# Altium schematic sheet Data_IO.SchDoc
size A3; SheetNumber: 1
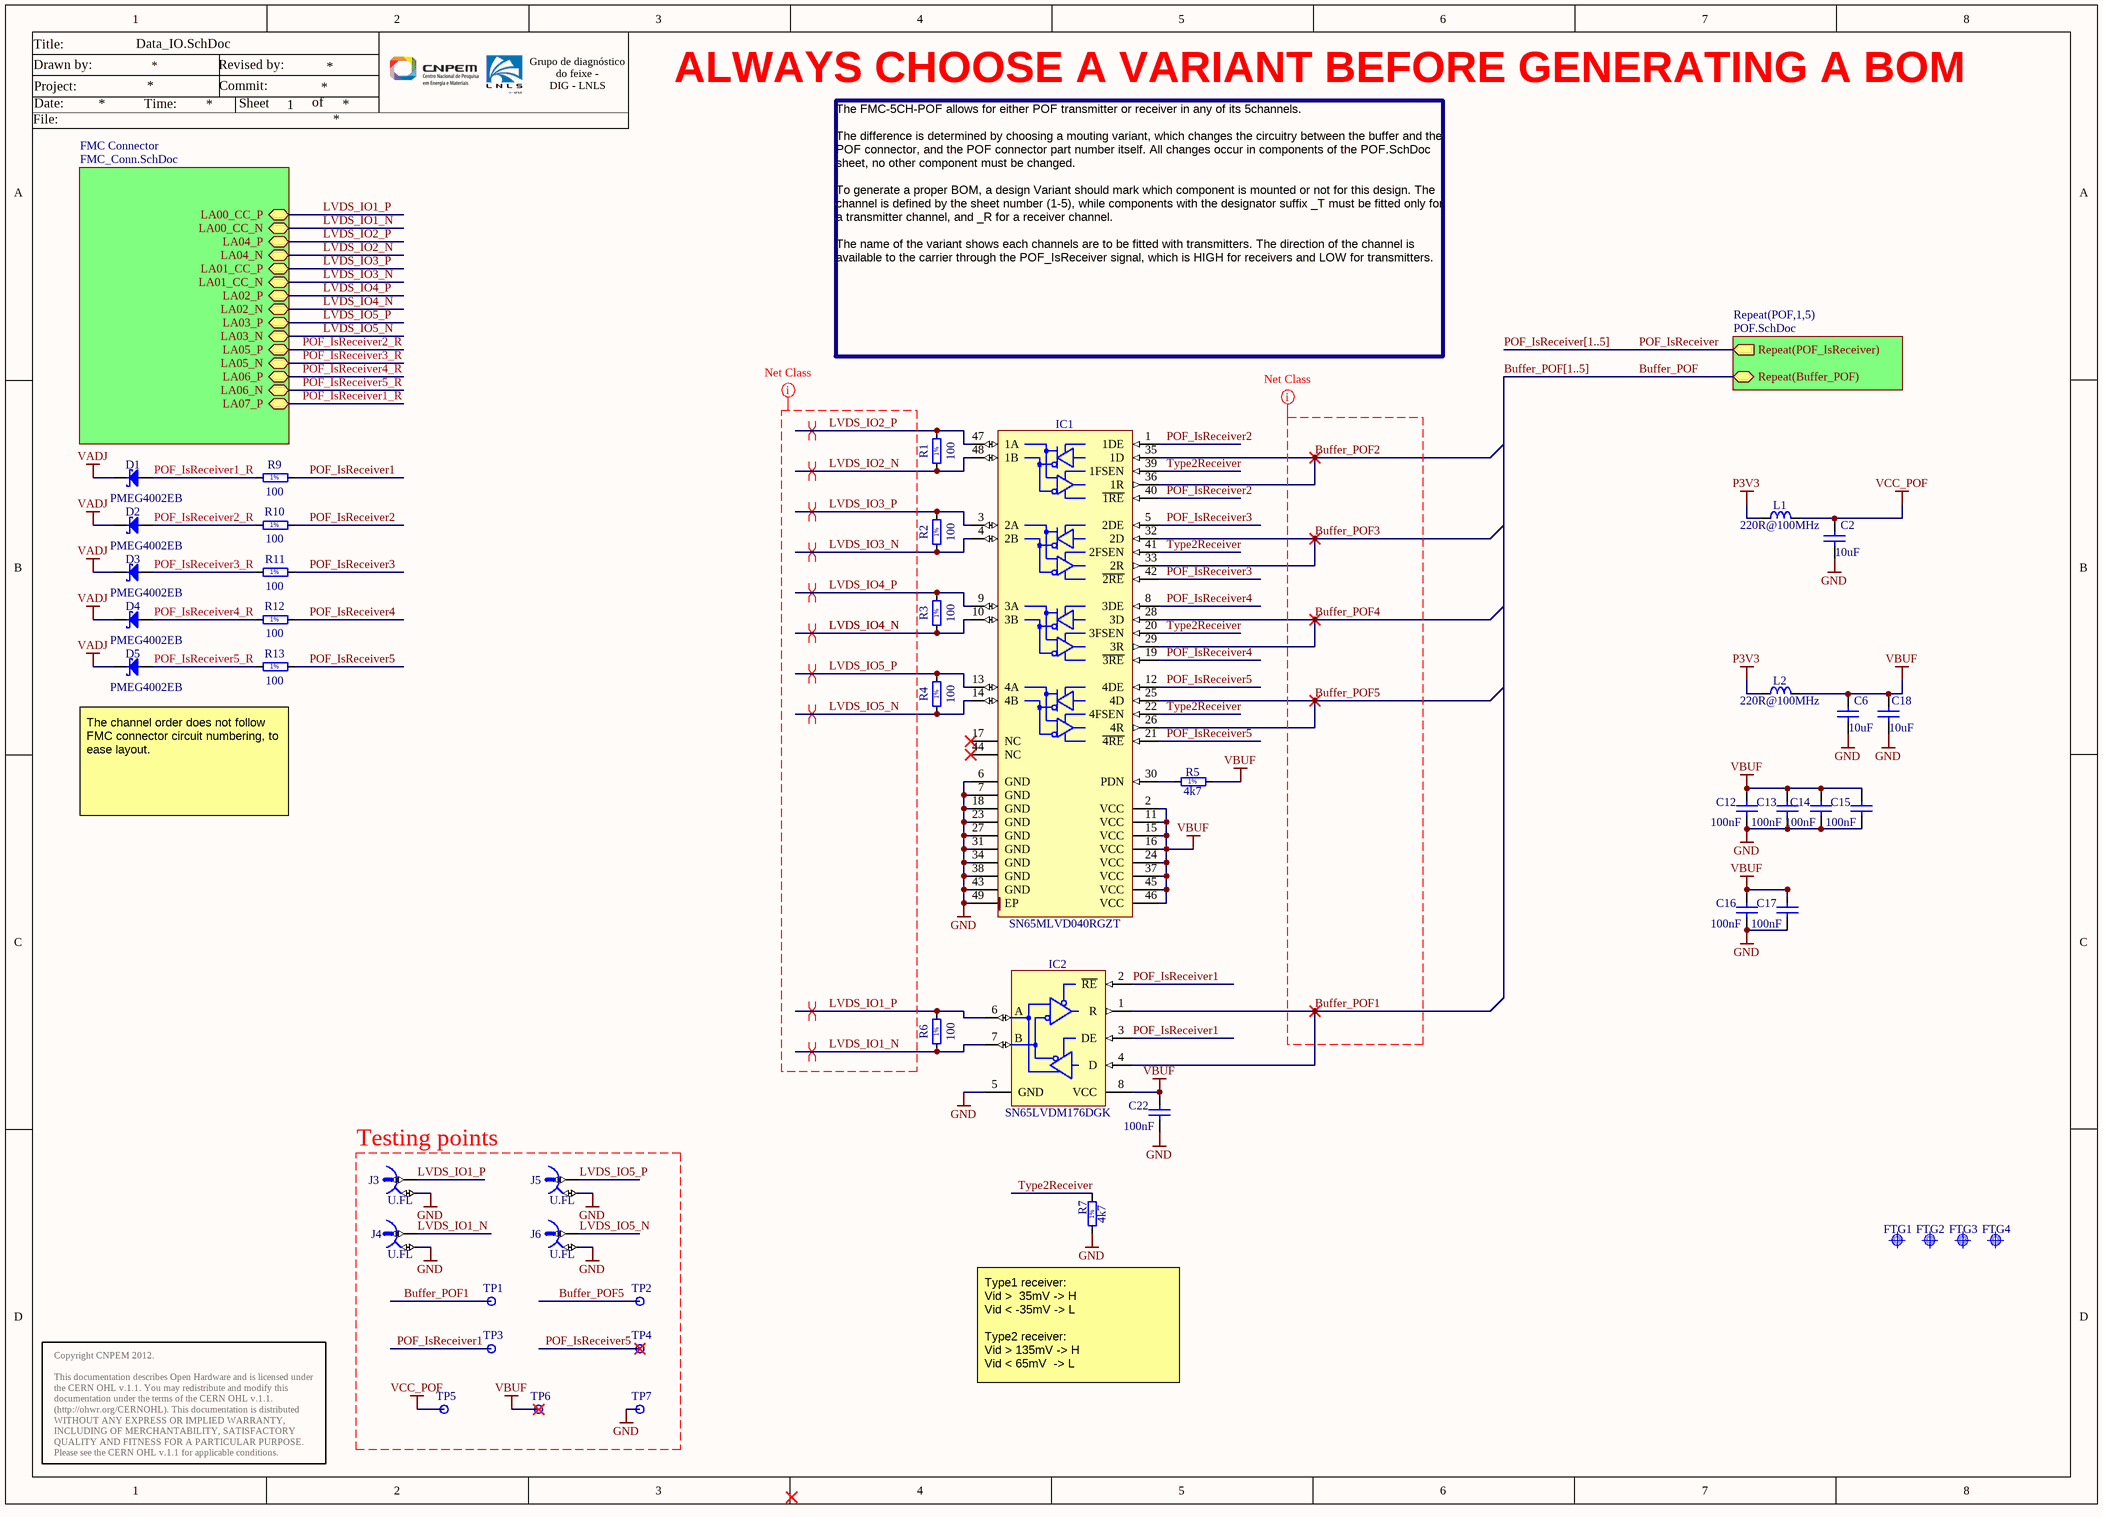
[diagram p0: Data_IO.SchDoc]

## Parts
C2  10uF  [CAPC2012X135N]
C6  10uF  [CAPC2012X135N]
C12  100nF  [CAPC1005X55N]
C13  100nF  [CAPC1005X55N]
C14  100nF  [CAPC1005X55N]
C15  100nF  [CAPC1005X55N]
C16  100nF  [CAPC1005X55N]
C17  100nF  [CAPC1005X55N]
C18  10uF  [CAPC2012X135N]
C22  100nF  [CAPC1005X55N]
D1  PMEG4002EB  [SODFL1608X65N]
D2  PMEG4002EB  [SODFL1608X65N]
D3  PMEG4002EB  [SODFL1608X65N]
D4  PMEG4002EB  [SODFL1608X65N]
D5  PMEG4002EB  [SODFL1608X65N]
FTG1  Use only in PCB  [FIDUCIAL_TOP_S100-200]  (value not drawn)
FTG2  Use only in PCB  [FIDUCIAL_TOP_S100-200]  (value not drawn)
FTG3  Use only in PCB  [FIDUCIAL_TOP_S100-200]  (value not drawn)
FTG4  Use only in PCB  [FIDUCIAL_TOP_S100-200]  (value not drawn)
IC1  SN65MLVD040RGZT  [QFN50P700X700X100-49N-S420]
IC2  SN65LVDM176DGK  [SOP65P490X110-8N]
J3  U.FL  [HIROSE_U.FL-R-SMT-1(10)]
J4  U.FL  [HIROSE_U.FL-R-SMT-1(10)]
J5  U.FL  [HIROSE_U.FL-R-SMT-1(10)]
J6  U.FL  [HIROSE_U.FL-R-SMT-1(10)]
L1  220R@100MHz  [INDC2012X105N]
L2  220R@100MHz  [INDC2012X105N]
R1  100  [RESC1005X40N]
R2  100  [RESC1005X40N]
R3  100  [RESC1005X40N]
R4  100  [RESC1005X40N]
R5  4k7  [RESC1005X40N]
R6  100  [RESC1005X40N]
R7  4k7  [RESC1005X40N]
R9  100  [RESC1005X40N]
R10  100  [RESC1005X40N]
R11  100  [RESC1005X40N]
R12  100  [RESC1005X40N]
R13  100  [RESC1005X40N]
TP1  Plated Hole  [c300h160]  (value not drawn)
TP2  Plated Hole  [c300h160]  (value not drawn)
TP3  Plated Hole  [c300h160]  (value not drawn)
TP4  Plated Hole  [c300h160]  (value not drawn)
TP5  Plated Hole  [c300h160]  (value not drawn)
TP6  Plated Hole  [c300h160]  (value not drawn)
TP7  Plated Hole  [c300h160]  (value not drawn)

## Sub-sheets
FMC Connector = FMC_Conn.SchDoc: LA00_CC_P, LA00_CC_N, LA04_N, LA04_P, LA01_CC_P, LA01_CC_N, LA02_N, LA02_P, LA03_N, LA03_P, LA06_P, LA06_N, LA07_P, LA05_P, LA05_N
Repeat(POF,1,5) = POF.SchDoc: Repeat(Buffer_POF) (bidir), Repeat(POF_IsReceiver) (out)

## Nets
GND: C2.1 C6.1 C12.1 C13.1 C14.1 C15.1 C16.1 C17.1 C18.1 C22.1 IC1.6(GND) IC1.7(GND) IC1.18(GND) IC1.23(GND) IC1.27(GND) IC1.31(GND) IC1.34(GND) IC1.38(GND) IC1.43(GND) IC1.49(EP) IC2.5(GND) J3.2 J4.2 J5.2 J6.2 R7.1 TP7.1
P3V3: L1.1 L2.1
VADJ: D1.1(C) D2.1(C) D3.1(C) D4.1(C) D5.1(C)
VBUF: C6.2 C12.2 C13.2 C14.2 C15.2 C16.2 C17.2 C18.2 C22.2 IC1.2(VCC) IC1.11(VCC) IC1.15(VCC) IC1.16(VCC) IC1.24(VCC) IC1.37(VCC) IC1.45(VCC) IC1.46(VCC) IC2.8(VCC) L2.2 R5.2 TP6.1
VCC_POF: C2.2 L1.2 TP5.1
Buffer_POF: sheet Repeat(POF,1,5)/Repeat(Buffer_POF)
Buffer_POF1: IC2.1(R) IC2.4(D) TP1.1
Buffer_POF2: IC1.35(1D) IC1.36(1R)
Buffer_POF3: IC1.32(2D) IC1.33(2R)
Buffer_POF4: IC1.28(3D) IC1.29(3R)
Buffer_POF5: IC1.25(4D) IC1.26(4R) TP2.1
LVDS_IO1_N: IC2.7(B) J4.1 R6.1 ; sheet FMC Connector/LA00_CC_N
LVDS_IO1_P: IC2.6(A) J3.1 R6.2 ; sheet FMC Connector/LA00_CC_P
LVDS_IO2_N: IC1.48(1B) R1.1 ; sheet FMC Connector/LA04_N
LVDS_IO2_P: IC1.47(1A) R1.2 ; sheet FMC Connector/LA04_P
LVDS_IO3_N: IC1.4(2B) R2.1 ; sheet FMC Connector/LA01_CC_N
LVDS_IO3_P: IC1.3(2A) R2.2 ; sheet FMC Connector/LA01_CC_P
LVDS_IO4_N: IC1.10(3B) R3.1 ; sheet FMC Connector/LA02_N
LVDS_IO4_P: IC1.9(3A) R3.2 ; sheet FMC Connector/LA02_P
LVDS_IO5_N: IC1.14(4B) J6.1 R4.1 ; sheet FMC Connector/LA03_N
LVDS_IO5_P: IC1.13(4A) J5.1 R4.2 ; sheet FMC Connector/LA03_P
POF_IsReceiver: sheet Repeat(POF,1,5)/Repeat(POF_IsReceiver)
POF_IsReceiver1: IC2.2(~{RE}) IC2.3(DE) R9.2 TP3.1
POF_IsReceiver1_R: D1.2(A) R9.1 ; sheet FMC Connector/LA07_P
POF_IsReceiver2: IC1.1(1DE) IC1.40(~{1RE}) R10.2
POF_IsReceiver2_R: D2.2(A) R10.1 ; sheet FMC Connector/LA05_P
POF_IsReceiver3: IC1.5(2DE) IC1.42(~{2RE}) R11.2
POF_IsReceiver3_R: D3.2(A) R11.1 ; sheet FMC Connector/LA05_N
POF_IsReceiver4: IC1.8(3DE) IC1.19(~{3RE}) R12.2
POF_IsReceiver4_R: D4.2(A) R12.1 ; sheet FMC Connector/LA06_P
POF_IsReceiver5: IC1.12(4DE) IC1.21(~{4RE}) R13.2 TP4.1
POF_IsReceiver5_R: D5.2(A) R13.1 ; sheet FMC Connector/LA06_N
Type2Receiver: IC1.20(3FSEN) IC1.22(4FSEN) IC1.39(1FSEN) IC1.41(2FSEN) R7.2
NetIC1_30: IC1.30(PDN) R5.1

Not connected (* = marked no-connect by the designer): IC1 17(NC)* 44(NC)*

## Buses and harness runs
bus Buffer_POF[1..5]
bus POF_IsReceiver[1..5]

## Layout directives
differential pair: LVDS_IO1_N, LVDS_IO1_P, LVDS_IO2_N, LVDS_IO2_P, LVDS_IO3_N, LVDS_IO3_P, LVDS_IO4_N, LVDS_IO4_P, LVDS_IO5_N, LVDS_IO5_P
Buffer_POF: BUFFER_POF: Buffer_POF1, Buffer_POF2, Buffer_POF3, Buffer_POF4, Buffer_POF5
net class LVDS_IO: LVDS_IO1_N, LVDS_IO1_P, LVDS_IO2_N, LVDS_IO2_P, LVDS_IO3_N, LVDS_IO3_P, LVDS_IO4_N, LVDS_IO4_P, LVDS_IO5_N, LVDS_IO5_P

## Notes on the sheet
- ALWAYS CHOOSE A VARIANT BEFORE GENERATING A BOM
- The FMC-5CH-POF allows for either POF transmitter or receiver in any of its 5channels.
  The difference is determined by choosing a mouting variant, which changes the circuitry between the buffer and the POF connector, and the POF connector part number itself. All changes occur in components of the POF.SchDoc sheet, no other component must be changed.
  To generate a proper BOM, a design Variant should mark which component is mounted or not for this design. The channel is defined by the sheet number (1-5), while components with the designator suffix _T must be fitted only for a transmitter channel, and _R for a receiver channel.
  The name of the variant shows each channels are to be fitted with transmitters. The direction of the channel is available to the carrier through the POF_IsReceiver signal, which is HIGH for receivers and LOW for transmitters.
- The channel order does not follow FMC connector circuit numbering, to ease layout.
- Testing points
- (near R7) Type1 receiver:
  Vid >  35mV -> H
  Vid < -35mV -> L
  Type2 receiver:
  Vid > 135mV -> H
  Vid < 65mV  -> L
- Title:
- Date:
- Project:
- Drawn by:
- Time:
- Commit:
- Revised by:
- Sheet
- of
- Grupo de diagnóstico do feixe -
  DIG - LNLS
- File:
- Copyright CNPEM 2012.
  This documentation describes Open Hardware and is licensed under the CERN OHL v.1.1. You may redistribute and modify this documentation under the terms of the CERN OHL v.1.1. (http://ohwr.org/CERNOHL). This documentation is distributed WITHOUT ANY EXPRESS OR IMPLIED WARRANTY, INCLUDING OF MERCHANTABILITY, SATISFACTORY QUALITY AND FITNESS FOR A PARTICULAR PURPOSE. Please see the CERN OHL v.1.1 for applicable conditions.
- (in symbol R0402_4K7_1%_0.0625W_100PPM) 1%
- (in symbol R0402_100R_1%_0.0625W_100PPM) 1%

## Library data of the parts
C2 C6 C18 = CC0805_10UF_10V_10%_X7R: Non-polarised capacitor; Part Description: SMD Multilayer Chip Ceramic Capacitor; Manufacturer: GENERIC; Manufacturer1 Part Number: GRM21BR71A106KE51L; Voltage: 10V; TC: X7R; Tolerance: ±10%; Part Number: CC0805_10UF_10V_10%_X7R; Component Kind: Standard; Component Type: Standard; Pin Count: 2; Value: 10uF; Status: Preferred; Manufacturer Part Number: CC0805_10UF_10V_10%_X7R; Case: 0805; Mounted: Yes; Socket: No; SMD: Yes; Sense: No; Manufacturer1 Example: MURATA; Manufacturer1 ComponentHeight: 1.35mm; HelpURL: \\cern.ch\dfs\Applications\Altium\Datasheets\CC0805_X7R_MURATA.pdf; Author: CERN DEM JLC; CreateDate: 30/04/2012; LatestRevisionDate: 30/04/2012
C12-C17 C22 = CC0402_100NF_16V_10%_X5R: Non-polarised capacitor; Part Description: SMD Multilayer Chip Ceramic Capacitor; Manufacturer: GENERIC; Manufacturer1 Part Number: GRM155R61C104KA88D; Voltage: 16V; TC: X5R; Tolerance: ±10%; Part Number: CC0402_100NF_16V_10%_X5R; Component Kind: Standard; Component Type: Standard; Pin Count: 2; Value: 100nF; Status: None; Manufacturer Part Number: CC0402_100NF_16V_10%_X5R; Case: 0402; Mounted: Yes; Socket: No; SMD: Yes; Sense: No; Manufacturer1 Example: MURATA; Manufacturer1 ComponentHeight: 0.55mm; HelpURL: \\cern.ch\dfs\Applications\Altium\Datasheets\CC0402_X5R_MURATA_GRM.pdf; Author: CERN DEM JLC; CreateDate: 10/12/2013; LatestRevisionDate: 10/12/2013
D1-D5 = PMEG4002EB: Schottky Diode; Part Description: Very Low VF MEGA Schottky Barrier Rectifier; Manufacturer: NXP SEMICONDUCTORS; Voltage: 40V; Power: 200mA; Bonding: No; PressFit: No; Part Number: PMEG4002EB; Component Kind: Standard; Component Type: Standard; Device: PMEG4002EB; PackageDescription: Ultra Small Outline Diode Flat Lead (SOD-523), Body; 1.2mm L X 0.8mm W X 0.65mm H, IPC Medium Density; Manufacturer Part Number: PMEG4002EB; Pin Count: 2; Case: SOD523; Mounted: Yes; Socket: No; SMD: Yes; ComponentHeight: 0.65mm; HelpURL: \\cern.ch\dfs\Applications\Altium\Datasheets\PMEG4002EB.pdf; Author: CERN DEM JMW; CreateDate: 21/04/2009; LatestRevisionDate: 07/05/2009; Sense: No
FTG1-FTG4 = FIDUCIAL_TARGET_S100-200: Fiducial Target; Part Description: Square Fiducial Target, Top Layer, 1.0mm, Top Solder 2.0mm, Keepout =2.0mm; Mounted: No; Part Number: FIDUCIAL_TARGET_S100-200; Component Kind: Standard (No BOM); Component Type: Standard (No BOM); Pin Count: 1; Family: Fiducial; Socket: No; SMD: Yes; Sense: No; Status: None; ComponentHeight: 0mm; HelpURL: Undefined; Author: CERN DEM JLC; CreateDate: 09/02/2010; LatestRevisionDate: 04/04/2012; PackageDescription: Square Fiducial Target, Top Layer, 1.0mm, Top Solder 2.0mm, Keepout =2.0mm
IC1 = SN65MLVD040RGZT: 4-Channel Half-Duplex M-LVDS Line Transceiver; Manufacturer: TEXAS INSTRUMENTS; PressFit: No; Bonding: No; Part Number: SN65MLVD040RGZT; Component Kind: Standard; Component Type: Standard; Device: SN65MLVD040RGZT; PackageDescription: QFN, 0.50mm Pitch, Square; 48 Pin, 7.00mm L X 7.00mm W X 1mm H body (W/Thermal Tab 4.2mm X 4.2mm), IPC Medium Density; Part Description: 4-Channel Half-Duplex M-LVDS Line Transceiver; Manufacturer Part Number: SN65MLVD040RGZT; Pin Count: 49; Case: QFN48; Mounted: Yes; Socket: No; SMD: Yes; Sense: No; ComponentHeight: 1mm; Author: CERN DEM JLC; HelpURL: \\cern.ch\dfs\Applications\Altium\Datasheets\SN65MLVD040RGZT.pdf; CreateDate: 17/03/2011; LatestRevisionDate: 17/03/2011
IC2 = SN65LVDM176DGK: Half-Duplex LVDM Transceiver; Part Description: High-Speed, Half-Duplex LVDM Transceiver; Manufacturer: TEXAS INSTRUMENTS; PressFit: No; Bonding: No; Part Number: SN65LVDM176DGK; Component Kind: Standard; Component Type: Standard; Device: SN65LVDM176DGK; PackageDescription: SOP, 0.65mm, Pitch; 8 Pin, 3.0mm W X 3.0mm L X 1.10mm H Body, IPC Medium Density; Manufacturer Part Number: SN65LVDM176DGK; Pin Count: 8; Case: SSOP8; Mounted: Yes; Socket: No; SMD: Yes; Sense: No; ComponentHeight: 1.1mm; Author: CERN DEM JLC; HelpURL: \\cern.ch\dfs\Applications\Altium\Datasheets\SN65LVDM176DGK.pdf; CreateDate: 18/07/2014; LatestRevisionDate: 18/07/2014
J3-J6 = HIROSE_U.FL-R-SMT-1(10): Part Description: Up to 6GHz Ultra Small Surface Mount Male Coaxial Connectors U.FL Series; Manufacturer: HIROSE (HRS); PressFit: No; Part Number: HIROSE_U.FL-R-SMT-1(10); Component Kind: Standard; Component Type: Standard; Pin Count: 2; Family: U.FL; Mounted: Yes; Socket: No; SMD: Yes; Sense: No; Status: None; Manufacturer Part Number: U.FL-R-SMT-1(10); ComponentHeight: 1.25mm; HelpURL: \\cern.ch\dfs\Applications\Altium\Datasheets\HIROSE_U.FL-R-SMT-1(10).pdf; Author: CERN DEM JLC; CreateDate: 24/03/2010; LatestRevisionDate: 24/03/2010
L1 L2 = IND0805_MURATA_BLM21PG221SN1D: Inductor; Part Description: SMD EMIFIL Suppression Chip Ferrite Bead; Manufacturer: MURATA; Power: 2A; Resistance: 0.05R; Tolerance: ±25%; Part Number: IND0805_MURATA_BLM21PG221SN1D; Component Kind: Standard; Component Type: Standard; Pin Count: 2; Value: 220R@100MHz; Status: None; Manufacturer Part Number: BLM21PG221SN1D; Case: 0805; Mounted: Yes; Socket: No; SMD: Yes; ComponentHeight: 1.05mm; HelpURL: \\cern.ch\dfs\Applications\Altium\Datasheets\IND0402_MURATA_BLM21P.pdf; Author: CERN DEM JLC; CreateDate: 25/01/2010; LatestRevisionDate: 25/01/2010; Sense: No
R1-R4 R6 R9-R13 = R0402_100R_1%_0.0625W_100PPM: Resistor - 1%; Part Description: General Purpose Thick Film Chip Resistor; Manufacturer: GENERIC; Manufacturer1 Part Number: 232270671001L; TC: ±100ppm/°C; Part Number: R0402_100R_1%_0.0625W_100PPM; Component Kind: Standard; Component Type: Standard; Pin Count: 2; Value: 100; Status: Not recommended; Power: 0.0625W; Tolerance: ±1%; Manufacturer Part Number: R0402_100R_1%_0.0625W_100PPM; Case: 0402; Mounted: Yes; Sense: No; Socket: No; SMD: Yes; Manufacturer1 Example: YAGEO PHYCOMP; Manufacturer1 ComponentHeight: 0.4mm; HelpURL: \\cern.ch\dfs\Applications\Altium\Datasheets\R0402_Phycomp_RC0402.pdf; Author: CERN DEM JLC; CreateDate: 03/12/2007; LatestRevisionDate: 17/10/2012
R5 R7 = R0402_4K7_1%_0.0625W_100PPM: Resistor - 1%; Part Description: General Purpose Thick Film Chip Resistor; Manufacturer: GENERIC; Manufacturer1 Part Number: 232270674702L; TC: ±100ppm/°C; Part Number: R0402_4K7_1%_0.0625W_100PPM; Component Kind: Standard; Component Type: Standard; Pin Count: 2; Value: 4k7; Status: Not recommended; Power: 0.0625W; Tolerance: ±1%; Manufacturer Part Number: R0402_4K7_1%_0.0625W_100PPM; Case: 0402; Mounted: Yes; Sense: No; Socket: No; SMD: Yes; Manufacturer1 Example: YAGEO PHYCOMP; Manufacturer1 ComponentHeight: 0.4mm; HelpURL: \\cern.ch\dfs\Applications\Altium\Datasheets\R0402_Phycomp_RC0402.pdf; Author: CERN DEM JLC; CreateDate: 03/12/2007; LatestRevisionDate: 17/10/2012
TP1-TP7 = PLATED_HOLE1.6_PAD3.0: Single Terminal Socket; Part Description: Plated Through Hole: Hole Dia.=1.6mm Pad Dia.=3.0mm; Mounted: No; Part Number: PLATED_HOLE1.6_PAD3.0; Component Kind: Standard (No BOM); Component Type: Standard (No BOM); Pin Count: 1; Family: Plated Hole; Socket: No; SMD: No; Sense: No; Status: None; ComponentHeight: 0mm; HelpURL: Undefined; Author: CERN DEM JMW; CreateDate: 05/11/2009; LatestRevisionDate: 05/11/2009; PackageDescription: Plated Through Hole: Hole Dia.=1.6mm Pad Dia.=3.0mm